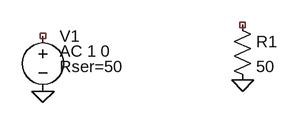
[diagram p0: schematic Linha_stub.asc]
Linha_stub.asc, the LTspice schematic file:
Version 4
SHEET 1 880 680
FLAG 64 176 0
FLAG 352 160 0
SYMBOL Voltage 64 80 R0
WINDOW 123 24 38 Left 2
WINDOW 39 24 60 Left 2
SYMATTR Value2 AC 1 0
SYMATTR SpiceLine Rser=50
SYMATTR InstName V1
SYMATTR Value ""
SYMBOL Res 336 64 R0
SYMATTR InstName R1
SYMATTR Value 50

The netlist it stands for:
* Linha_stub.asc
V1 NC_01 0 AC 1 0 Rser=50
R1 NC_02 0 50
.backanno
.end